# Altium schematic sheet VEmulator.SchDoc: Shepherd - Emulator
size 379 x 240 mm; Author: Ingmar; CompanyName: NES Lab / TU Dresden; DocumentNumber: 5; SheetNumber: 5
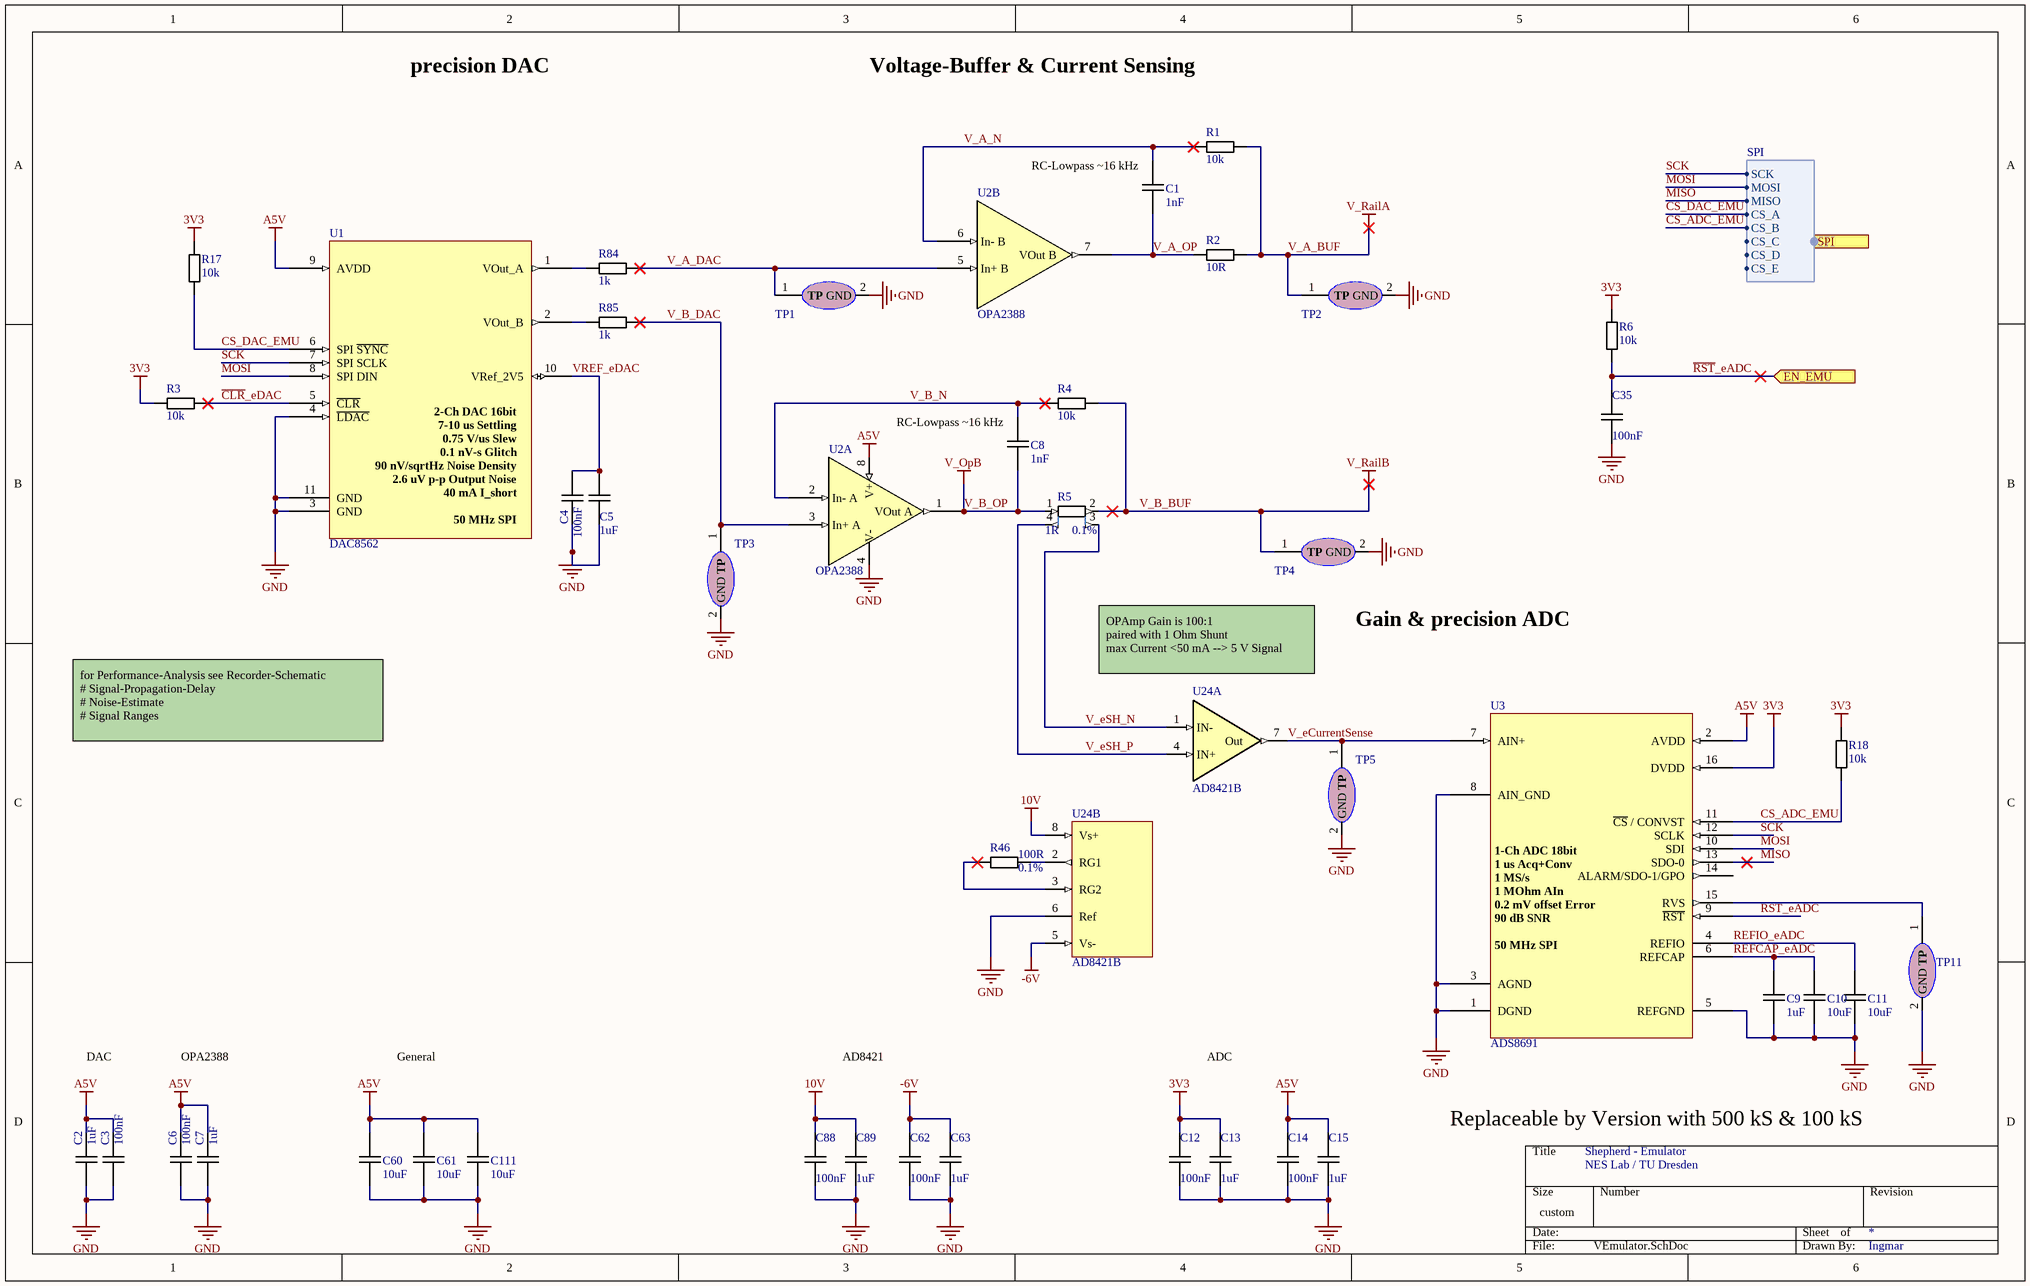
[diagram p0: VEmulator.SchDoc]

## Parts
C1  value 1nF  [CAPC1005X06]  (hidden comment: C_0402_1nF_50V)
C2  value 1uF  [CAPC1005X06]  (hidden comment: C_0402_1uF_25V)
C3  value 100nF  [CAPC1005X06]  (hidden comment: C_0402_100nF_16V)
C4  value 100nF  [CAPC1005X06]  (hidden comment: C_0402_100nF_16V)
C5  value 1uF  [CAPC1005X06]  (hidden comment: C_0402_1uF_25V)
C6  value 100nF  [CAPC1005X06]  (hidden comment: C_0402_100nF_16V)
C7  value 1uF  [CAPC1005X06]  (hidden comment: C_0402_1uF_25V)
C8  value 1nF  [CAPC1005X06]  (hidden comment: C_0402_1nF_50V)
C9  value 1uF  [CAPC1005X06]  (hidden comment: C_0402_1uF_25V)
C10  value 10uF  [CAPC1608X09]  (hidden comment: C_0603_10uF_16V)
C11  value 10uF  [CAPC1608X09]  (hidden comment: C_0603_10uF_16V)
C12  value 100nF  [CAPC1005X06]  (hidden comment: C_0402_100nF_16V)
C13  value 1uF  [CAPC1005X06]  (hidden comment: C_0402_1uF_25V)
C14  value 100nF  [CAPC1005X06]  (hidden comment: C_0402_100nF_16V)
C15  value 1uF  [CAPC1005X06]  (hidden comment: C_0402_1uF_25V)
C35  value 100nF  [CAPC1005X06]  (hidden comment: C_0402_100nF_16V)
C60  value 10uF  [CAPC1608X09]  (hidden comment: C_0603_10uF_16V)
C61  value 10uF  [CAPC1608X09]  (hidden comment: C_0603_10uF_16V)
C62  value 100nF  [CAPC1005X06]  (hidden comment: C_0402_100nF_16V)
C63  value 1uF  [CAPC1005X06]  (hidden comment: C_0402_1uF_25V)
C88  value 100nF  [CAPC1005X06]  (hidden comment: C_0402_100nF_16V)
C89  value 1uF  [CAPC1005X06]  (hidden comment: C_0402_1uF_25V)
C111  value 10uF  [CAPC1608X09]  (hidden comment: C_0603_10uF_16V)
R1  value 10k  [RESC1005X04]  (hidden comment: R_0402_10k)
R2  value 10R  [RESC1005X04]  (hidden comment: R_0402_10R)
R3  value 10k  [RESC1005X04]  (hidden comment: R_0402_10k)
R4  value 10k  [RESC1005X04]  (hidden comment: R_0402_10k)
R5  value 1R  Tolerance: 0.1%  [RESC3116X06 Shunt]  (hidden comment: R_1206_1R_0.1%)
R6  value 10k  [RESC1005X04]  (hidden comment: R_0402_10k)
R17  value 10k  [RESC1005X04]  (hidden comment: R_0402_10k)
R18  value 10k  [RESC1005X04]  (hidden comment: R_0402_10k)
R46  value 100R  Tolerance: 0.1%  [RESC1608X06N]  (hidden comment: R_0603_100R_0.1%)
R84  value 1k  [RESC1005X04]  (hidden comment: R_0402_1k)
R85  value 1k  [RESC1005X04]  (hidden comment: R_0402_1k)
TP1  Testpoint  [P_Testpins_Precision]  (value not drawn)  (no BOM)
TP2  Testpoint  [P_Testpins_Precision]  (value not drawn)  (no BOM)
TP3  Testpoint  [P_Testpins_Precision]  (value not drawn)  (no BOM)
TP4  Testpoint  [P_Testpins_Precision]  (value not drawn)  (no BOM)
TP5  Testpoint  [P_Testpins_Precision]  (value not drawn)  (no BOM)
TP11  Testpoint  [P_Testpins_Precision]  (value not drawn)  (no BOM)
U1  DAC8562  [PSON50P300X80_HS-11N]
U2  OPA2388  [TSOP65P490X110-8N]  (parts A,B of 2)
U3  ADS8691  [TSOP65P640X120-16N]
U24  AD8421B  [TSOP65P490X110-8N]  (parts A,B of 2)

## Ports
EN_EMU (in), SPI (in, harness SPI)

## Harnesses
SPI: SCK, MOSI, MISO, CS_A, CS_B, CS_C, CS_D, CS_E

## Nets
3V3: C12.2 C13.2 R3.2 R6.1 R17.2 R18.1 U3.16(DVDD)
10V: C88.2 C89.2 U24.8(Vs+)
-6V: C62.2 C63.2 U24.5(Vs-)
A5V: C2.2 C3.2 C6.2 C7.2 C14.2 C15.2 C60.2 C61.2 C111.2 U1.9(AVDD) U2.8(V+) U3.2(AVDD)
GND: C2.1 C3.1 C4.2 C5.1 C6.1 C7.1 C9.1 C10.1 C11.1 C12.1 C13.1 C14.1 C15.1 C35.1 C60.1 C61.1 C62.1 C63.1 C88.1 C89.1 C111.1 TP1.2(GND) TP2.2(GND) TP3.2(GND) TP4.2(GND) TP5.2(GND) TP11.2(GND) U1.3(GND) U1.4(~{LDAC}) U1.11(GND) U2.4(V-) U3.1(DGND) U3.3(AGND) U3.5(REFGND) U3.8(AIN_GND) U24.6(Ref)
V_A_BUF: R1.1 R2.2 TP2.1(TP)  [also labelled V_RailA]
V_B_BUF: R4.1 R5.2 TP4.1(TP)  [also labelled V_RailB]
V_B_OP: C8.1 R5.1 U2.1(VOut_A)  [also labelled V_OpB]
~{CLR}_eDAC: R3.1 U1.5(~{CLR})
CS_ADC_EMU: R18.2 U3.11(~{CS}_/_CONVST) ; port SPI.CS_B
CS_DAC_EMU: R17.1 U1.6(SPI_~{SYNC}) ; port SPI.CS_A
MISO: U3.13(SDO-0) ; port SPI.MISO
MOSI: U1.8(SPI_DIN) U3.10(SDI) ; port SPI.MOSI
~{RST}_eADC: C35.2 R6.2 U3.9(~{RST}) ; port EN_EMU
REFCAP_eADC: C9.2 C10.2 U3.6(REFCAP)
REFIO_eADC: C11.2 U3.4(REFIO)
SCK: U1.7(SPI_SCLK) U3.12(SCLK) ; port SPI.SCK
V_A_DAC: R84.2 TP1.1(TP) U2.5(In+_B)
V_A_N: C1.2 R1.2 U2.6(In-_B)
V_A_OP: C1.1 R2.1 U2.7(VOut_B)
V_B_DAC: R85.2 TP3.1(TP) U2.3(In+_A)
V_B_N: C8.2 R4.2 U2.2(In-_A)
V_eCurrentSense: TP5.1(TP) U3.7(AIN+) U24.7(Out)
V_eSH_N: R5.3 U24.1(IN-)
V_eSH_P: R5.4 U24.4(IN+)
VREF_eDAC: C4.1 C5.2 U1.10(VRef_2V5)
NetR46_1: R46.1 U24.3(RG2)
NetR46_2: R46.2 U24.2(RG1)
NetR84_1: R84.1 U1.1(VOut_A)
NetR85_1: R85.1 U1.2(VOut_B)
NetTP11_1: TP11.1(TP) U3.15(RVS)

Not connected (* = marked no-connect by the designer): U3 14(ALARM/SDO-1/GPO)

## Notes on the sheet
- precision DAC
- Voltage-Buffer & Current Sensing
- (near C1) RC-Lowpass ~16 kHz
- (near C8) RC-Lowpass ~16 kHz
- Gain & precision ADC
- OPAmp Gain is 100:1
  paired with 1 Ohm Shunt
  max Current <50 mA --> 5 V Signal
- for Performance-Analysis see Recorder-Schematic
  # Signal-Propagation-Delay
  # Noise-Estimate
  # Signal Ranges
- DAC
- OPA2388
- General
- AD8421
- ADC
- Replaceable by Version with 500 kS & 100 kS
- (in symbol ADS8691) 1-Ch ADC 18bit / 1 us Acq+Conv / 1 MS/s / 1 MOhm AIn / 0.2 mV offset Error / 90 dB SNR / 50 MHz SPI /
- (in symbol DAC8562-DSC) 2-Ch DAC 16bit / 7-10 us Settling / 0.75 V/us Slew / 0.1 nV-s Glitch / 90 nV/sqrtHz Noise Density / 2.6 uV p-p Output Noise / 40 mA I_short / 50 MHz SPI

## Library data of the parts
C1 C8 = .C_0402_1nF_50V: Capacitor; Manufacturer: Murata; Manufacturer PN: GRM1555C1H102JA01D; V_max: 50V; Tolerance: 5%; Dielectric: C0G; Distributer: Mouser; Distributer PN: 81-GRM1555C1H102JA1D; Price n10 [€]: 0.02
C2 C5 C7 C9 C13 C15 C63 C89 = .C_0402_1uF_25V: Capacitor; Manufacturer: Murata; Manufacturer PN: GRM155R61E105KA12J; V_max: 25V; Tolerance: 10%; Dielectric: X5R; Distributer: Mouser; Distributer PN: 81-GRM155R61E105KA2J; Price n10 [€]: 0.06
C3 C4 C6 C12 C14 C35 C62 C88 = .C_0402_100nF_16V: Capacitor; Manufacturer: Taiyo Yuden; Manufacturer PN: EMF105B7104MVHF; V_max: 16V; Tolerance: 20%; Dielectric: X7R; Distributer: Mouser; Distributer PN: 963-EMF105B7104MVHF; Price n10 [€]: 0.03
C10 C11 C60 C61 C111 = .C_0603_10uF_16V: Capacitor; Manufacturer: Taiyo Yuden; Manufacturer PN: EMK107BBJ106MA-T; V_max: 16V; Tolerance: 20%; Dielectric: X5R; Distributer: Mouser; Distributer PN: 963-EMK107BBJ106MA-T; Price n10 [€]: 0.14
R1 R3 R4 R6 R17 R18 = .R_0402_10k: Resistor; Manufacturer: Panasonic; Manufacturer PN: ERJ-2GEJ103X; P_max: 100mW; V_max: 50V; Tolerance: 5%; Distributer: Mouser; Distributer PN: 667-ERJ-2GEJ103X; Price n10 [€]: 0.02
R2 = .R_0402_10R: Resistor; Manufacturer: Panasonic; Manufacturer PN: ERJ-2GEJ100X; P_max: 100mW; V_max: 50V; Tolerance: 5%; Distributer: Mouser; Distributer PN: 667-ERJ-2GEJ100X; Price n10 [€]: 0.02
R5 = .R_1206_1R_0.1%: Resistor 25 ppm/C; Manufacturer: Yageo; Manufacturer PN: RT1206BRD071RL; P_max: 250mW; V_max: 200V; Distributer: Mouser; Distributer PN: 603-RT1206BRD071RL; Price n10 [€]: 0.32
R46 = .R_0603_100R_0.1%: Resistor; Manufacturer: Panasonic; Manufacturer PN: ERA-3AEB101V; P_max: 100mW; V_max: 75V; Distributer: Mouser; Distributer PN: 667-ERA-3AEB101V; Price n10 [€]: 0.25
R84 R85 = .R_0402_1k: Resistor; Manufacturer: Panasonic; Manufacturer PN: ERJ-2GEJ102X; P_max: 100mW; V_max: 50V; Tolerance: 5%; Distributer: Mouser; Distributer PN: 667-ERJ-2GEJ102X; Price n10 [€]: 0.02
TP1-TP5 TP11 = Testpoint_Precision
U1 = DAC8562-DSC: DAC, 2 CH, 10 us Settling, 16 bit Res, 50 MHz SPI; Manufacturer: TI; Manufacturer PN: DAC8562SDSCR; V_max: 5.5V; V_min: 2.7V; Distributer: Mouser; Distributer PN: 595-DAC8562SDSCR; Price n10 [€]: 6.73
U2 = OPA2388: OpAmp High Precision, 30-60 mA perm, 5 V/us Slew, 7 nV/sqrtHz NoiseDist, 0.25 uV Offset, Z_id 100 MOhm, Z_ic 60 TOhm; Manufacturer: TI; Manufacturer PN: OPA2388IDGKR; V_max: 5.5V; V_min: 2.5V; Distributer: Mouser; Distributer PN: 595-OPA2388IDGKR; Price n10 [€]: 2.63
U3 = ADS8691: ADC, 1CH, 18 Bit, 1 MS/s, 50 MHz SPI, 335 ns Acq & 665 ns Conv; Manufacturer: TI; Manufacturer PN: ADS8691IPWR; V_max: 5.25V; V_min: 1.65V; Distributer: Mouser; Distributer PN: 595-ADS8691IPWR; Price n10 [€]: 8.5
U24 = AD8421B: Low Noise InAmp, / 134 dB CMRR @ G100, f60Hz / 0.1 % Gain Error / 10 ppm Gain NonLin / 65mA max Output; Manufacturer: Analog; Manufacturer PN: AD8421BRMZ; I_max: 2.3mA; V_max: 18V; V_min: 2.5V; Distributer: Mouser; Distributer PN: 584-AD8421BRMZ; Price n10 [€]: 8.10